# EAGLE design BlackBoard-Artemis (EAGLE 9.3.0)

## Sheet 1 of 2
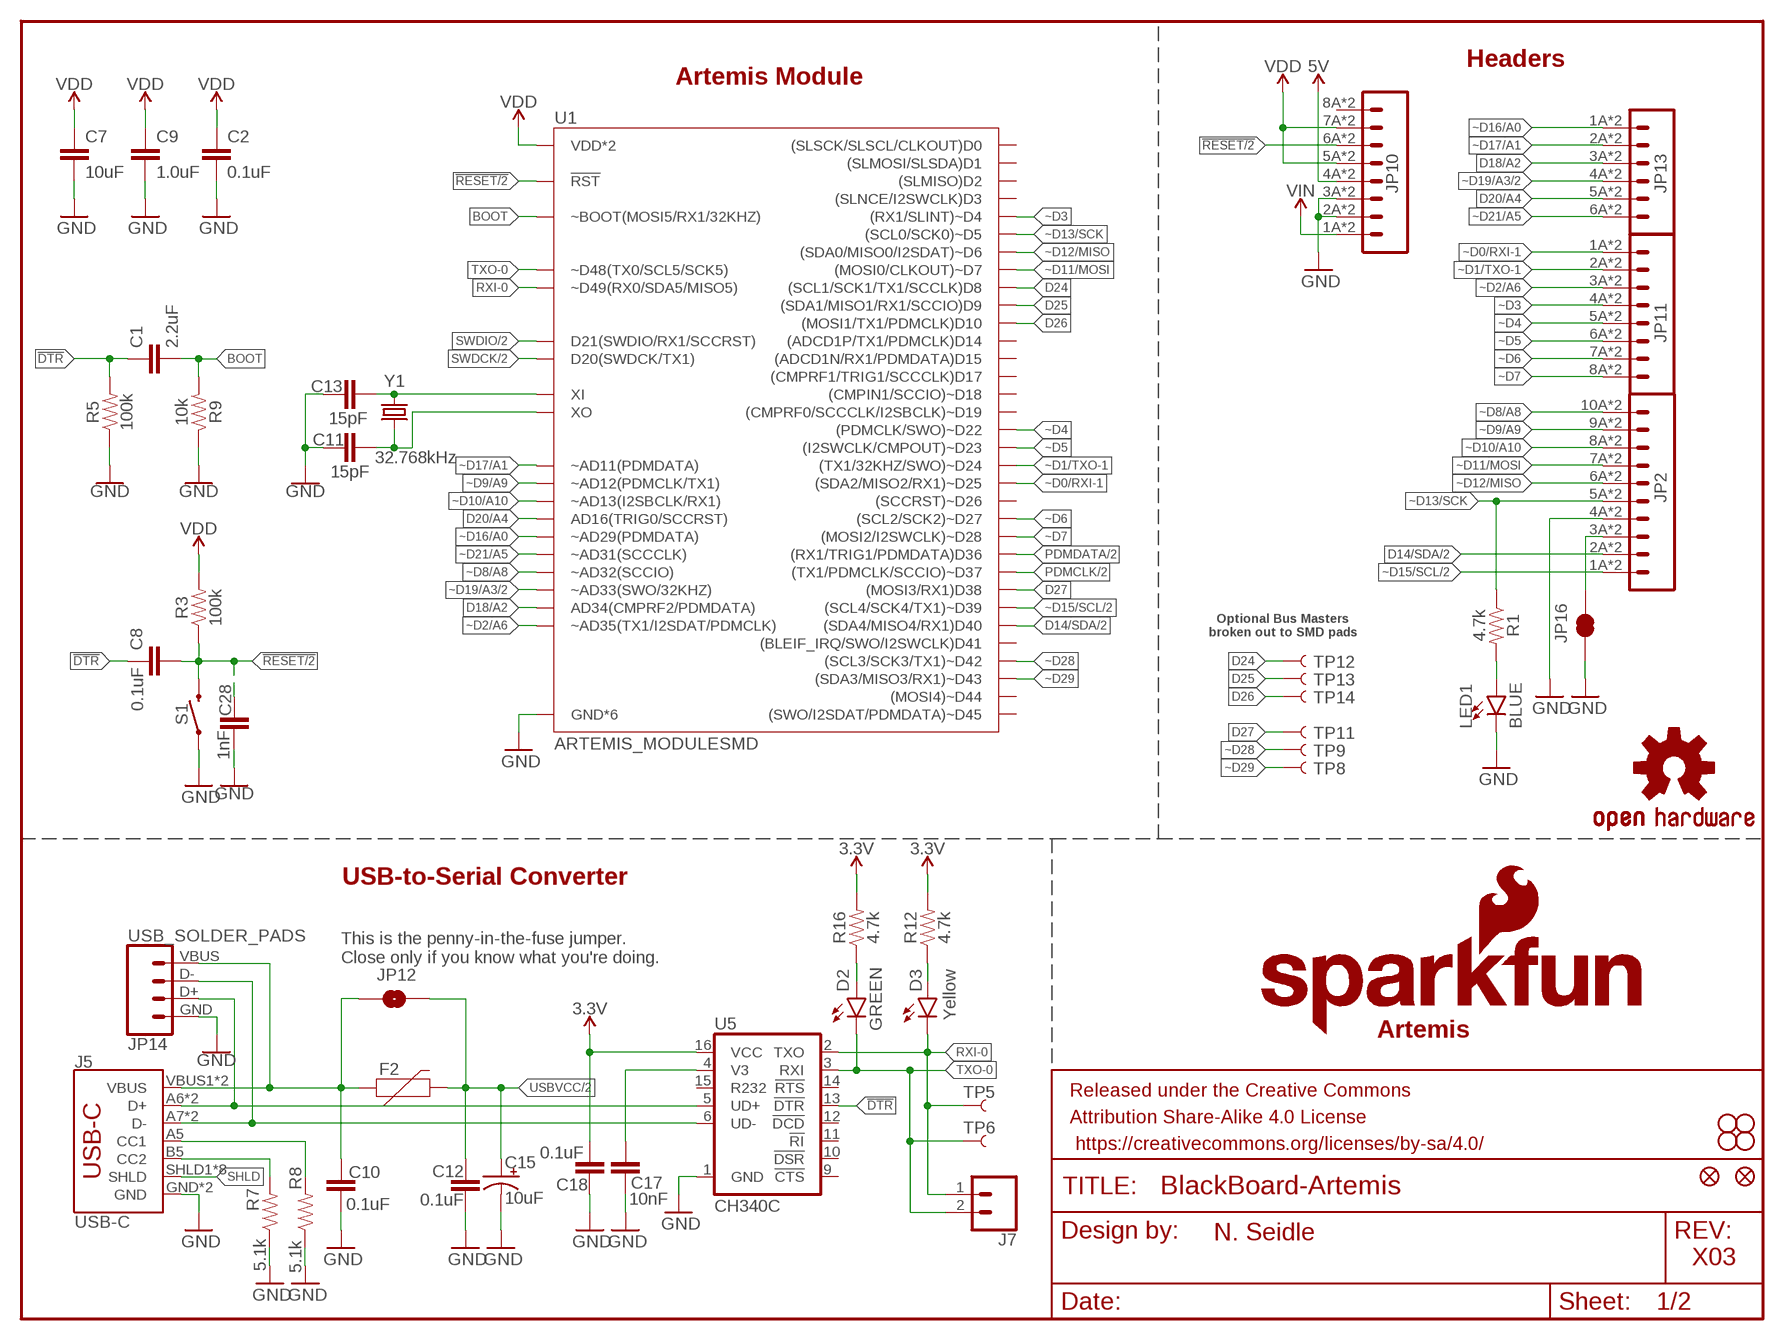
[diagram p0: schematic, sheet 1]

### Parts
C1  2.2uF  2.2UF-0603-10V-20%  [0603]
C2  0.1uF  0.1UF-0603-25V-(+80/-20%)  [0603]
C7  10uF  10UF-0603-6.3V-20%  [0603]
C8  0.1uF  0.1UF-0603-25V-5%  [0603]
C9  1.0uF  1.0UF-0603-16V-10%  [0603]
C10  0.1uF  0.1UF-0603-25V-(+80/-20%)  [0603]
C11  15pF  15PF-0603-50V-5%  [0603]
C12  0.1uF  0.1UF-0603-25V-(+80/-20%)  [0603]
C13  15pF  15PF-0603-50V-5%  [0603]
C15  10uF  10UF-POLAR-EIA3216-16V-10%(TANT)  [EIA3216]
C17  10nF  10NF-0603-50V-10%  [0603]
C18  0.1uF  0.1UF-0603-25V-(+80/-20%)  [0603]
C28  1nF  1.0NF/1000PF-0603-50V-10%  [0603]
D2  GREEN  LED-GREENLILYPAD  [LED-1206]
D3  Yellow  LED-YELLOWLILYPAD  [LED-1206]
F2  6V/2A  PPTC_6V2A  [1210]
FRAME1  FRAME-LETTER  [CREATIVE_COMMONS]
J5  USB-C  USB_C  [USB-C-16P]
J7  CONN_021X02_NO_SILK  [1X02_NO_SILK]
JP1  SFE_LOGO_NAME.1_INCH  [SFE_LOGO_NAME_.1]
JP2  M10SMD_COMBO  [1X10_SMD_COMBINED]
JP3  STAND-OFF  [STAND-OFF]
JP4  STAND-OFF  [STAND-OFF]
JP5  STAND-OFF  [STAND-OFF]
JP6  STAND-OFF  [STAND-OFF]
JP7  SFE_LOGO_FLAME.1_INCH  [SFE_LOGO_FLAME_.1]
JP8  FIDUCIAL1X2  [FIDUCIAL-1X2]
JP9  FIDUCIAL1X2  [FIDUCIAL-1X2]
JP10  M08SMD-COMBO  [1X08_SMD_COMBINED]
JP11  JP11  M08SMD-COMBO  [1X08_SMD_COMBINED]
JP12  JUMPER-SMT_2_NO_SILK  [SMT-JUMPER_2_NO_SILK]
JP13  M06SMD-STRAIGHT-COMBO  [1X06_SMD_STRAIGHT_COMBO]
JP14  USB_SOLDER_PADS  [USB-SOLDER-PADS]
JP16  JUMPER-SMT_2_NC_TRACE_SILK  [SMT-JUMPER_2_NC_TRACE_SILK]
LED1  BLUE  LED-BLUE1206  [LED-1206]
R1  4.7k  4.7KOHM-0603-1/10W-1%  [0603]
R3  100k  100KOHM-0603-1/10W-1%  [0603]
R5  100k  100KOHM-0603-1/10W-1%  [0603]
R7  5.1k  5.1KOHM5.1KOHM-0603-1/10W-1%  [0603]
R8  5.1k  5.1KOHM5.1KOHM-0603-1/10W-1%  [0603]
R9  10k  10KOHM-0603-1/10W-1%  [0603]
R12  4.7k  4.7KOHM-0603-1/10W-1%  [0603]
R16  4.7k  4.7KOHM-0603-1/10W-1%  [0603]
S1  MOMENTARY-SWITCH-SPST-SMD-5.2-TALL-REDUNDANT  [TACTILE_SWITCH_SMD_5.2MM]
TP5  TEST-POINT3X5  [PAD.03X.05]
TP6  TEST-POINT3X5  [PAD.03X.05]
TP8  TEST-POINT3X5  [PAD.03X.05]
TP9  TEST-POINT3X5  [PAD.03X.05]
TP11  TEST-POINT3X5  [PAD.03X.05]
TP12  TEST-POINT3X5  [PAD.03X.05]
TP13  TEST-POINT3X5  [PAD.03X.05]
TP14  TEST-POINT3X5  [PAD.03X.05]
U1  ARTEMIS_MODULESMD  [ARTEMIS_FP]
U5  CH340C  [SO016]
U$16  OSHW-LOGOS  [OSHW-LOGO-S]
Y1  32.768kHz  CRYSTAL-32.768KHZSMD-3.2X1.5  [CRYSTAL-SMD-3.2X1.5MM]

### Nets
3.3V: C18.1 R12.2 R16.2 U5.16(VCC) ; also sheet 2
5V [power]: JP10.4A JP10.4B ; also sheet 2
!DTR: C1.1 C8.1 R5.2 U5.13(!DTR)
!RESET: C8.2 C28.1 JP10.6A JP10.6B R3.1 S1.3 S1.4 U1.~RST(!RST) ; also sheet 2
BOOT: C1.2 R9.2 U1.BOOT(~BOOT(MOSI5/RX1/32KHZ))
CC1: J5.A5(CC1) R8.2
CC2: J5.B5(CC2) R7.2
D14/SDA: JP2.2A JP2.2B U1.D40((SDA4/MISO4/RX1)D40) ; also sheet 2
D18/A2: JP13.3A JP13.3B U1.AD34(AD34(CMPRF2/PDMDATA))
D20/A4: JP13.5A JP13.5B U1.AD16(AD16(TRIG0/SCCRST))
D24: TP12.P$1 U1.D8((SCL1/SCK1/TX1/SCCLK)D8)
D25: TP13.P$1 U1.D9((SDA1/MISO1/RX1/SCCIO)D9)
D26: TP14.P$1 U1.D10((MOSI1/TX1/PDMCLK)D10)
D27: TP11.P$1 U1.D38((MOSI3/RX1)D38)
D+: J5.A6(D+) J5.B6(D+) JP14.D+ U5.5(UD+)
D-: J5.A7(D-) J5.B7(D-) JP14.D- U5.6(UD-)
GND: C2.1 C7.2 C9.2 C10.2 C11.1 C12.2 C13.1 C15.- C17.2 C18.2 C28.2 J5.GND J5.GND2(GND) JP2.4A JP2.4B JP10.2A JP10.2B JP10.3A JP10.3B JP14.GND JP16.1 LED1.C R5.1 R7.1 R8.1 R9.1 S1.1 S1.2 U1.GND@1(GND*6) U1.GND@22(GND*6) U1.GND@38(GND*6) U1.GND@39(GND*6) U1.GND@47(GND*6) U1.GND@59(GND*6) U5.1(GND) ; also sheet 2
N$1: LED1.A R1.2
N$5: D2.A R16.1
N$6: C17.1 U5.4(V3)
N$7: C11.2 U1.XO Y1.P$2
N$8: C13.2 U1.XI Y1.P$1
N$9: D3.A R12.1
N$10: JP2.3A JP2.3B JP16.2
PDMCLK: U1.~D37((TX1/PDMCLK/SCCIO)~D37) ; also sheet 2
PDMDATA: U1.D36((RX1/TRIG1/PDMDATA)D36) ; also sheet 2
RXI-0: D3.C J7.1 TP5.P$1 U1.RXI-0(~D49(RX0/SDA5/MISO5)) U5.2(TXO)
SHLD: J5.SHLD1(SHLD) J5.SHLD2(SHLD) J5.SHLD3(SHLD) J5.SHLD4(SHLD) J5.SHLD5(SHLD) J5.SHLD6(SHLD) J5.SHLD7(SHLD) J5.SHLD8(SHLD)
SWDCK: U1.SWDCK(D20(SWDCK/TX1)) ; also sheet 2
SWDIO: U1.SWDIO(D21(SWDIO/RX1/SCCRST)) ; also sheet 2
TXO-0: D2.C J7.2 TP6.P$1 U1.TXO-0(~D48(TX0/SCL5/SCK5)) U5.3(RXI)
USBVCC [power]: C12.1 C15.+ F2.2 JP12.2 ; also sheet 2
VDD: C2.2 C7.1 C9.1 JP10.5A JP10.5B JP10.7A JP10.7B R3.2 U1.VDD@36(VDD*2) U1.VDD@37(VDD*2) ; also sheet 2
VIN [power]: JP10.1A JP10.1B ; also sheet 2
VUSB [power]: C10.1 F2.1 J5.VBUS1(VBUS) J5.VBUS2(VBUS) JP12.1 JP14.VBUS
~D0/RXI-1: JP11.1A JP11.1B U1.~D25((SDA2/MISO2/RX1)~D25)
~D1/TXO-1: JP11.2A JP11.2B U1.~D24((TX1/32KHZ/SWO)~D24)
~D2/A6: JP11.3A JP11.3B U1.~AD35(~AD35(TX1/I2SDAT/PDMCLK))
~D3: JP11.4A JP11.4B U1.~D4((RX1/SLINT)~D4)
~D4: JP11.5A JP11.5B U1.~D22((PDMCLK/SWO)~D22)
~D5: JP11.6A JP11.6B U1.~D23((I2SWCLK/CMPOUT)~D23)
~D6: JP11.7A JP11.7B U1.~D27((SCL2/SCK2)~D27)
~D7: JP11.8A JP11.8B U1.~D28((MOSI2/I2SWCLK)~D28)
~D8/A8: JP2.10A JP2.10B U1.~AD32(~AD32(SCCIO))
~D9/A9: JP2.9A JP2.9B U1.~AD12(~AD12(PDMCLK/TX1))
~D10/A10: JP2.8A JP2.8B U1.~AD13(~AD13(I2SBCLK/RX1))
~D11/MOSI: JP2.7A JP2.7B U1.D7((MOSI0/CLKOUT)~D7)
~D12/MISO: JP2.6A JP2.6B U1.~D6((SDA0/MISO0/I2SDAT)~D6)
~D13/SCK: JP2.5A JP2.5B R1.1 U1.~D5((SCL0/SCK0)~D5)
~D15/SCL: JP2.1A JP2.1B U1.~D39((SCL4/SCK4/TX1)~D39) ; also sheet 2
~D16/A0: JP13.1A JP13.1B U1.~AD29(~AD29(PDMDATA))
~D17/A1: JP13.2A JP13.2B U1.~AD11(~AD11(PDMDATA))
~D19/A3: JP13.4A JP13.4B U1.~AD33/SWO(~AD33(SWO/32KHZ)) ; also sheet 2
~D21/A5: JP13.6A JP13.6B U1.~AD31(~AD31(SCCCLK))
~D28: TP9.P$1 U1.~D42((SCL3/SCK3/TX1)~D42)
~D29: TP8.P$1 U1.~D43((SDA3/MISO3/RX1)~D43)
Unconnected: JP10.8A JP10.8B U1.D0((SLSCK/SLSCL/CLKOUT)D0) U1.D1((SLMOSI/SLSDA)D1) U1.D2((SLMISO)D2) U1.D3((SLNCE/I2SWCLK)D3) U1.D14((ADCD1P/TX1/PDMCLK)D14) U1.D15((ADCD1N/RX1/PDMDATA)D15) U1.D17((CMPRF1/TRIG1/SCCCLK)D17) U1.D41((BLEIF_IRQ/SWO/I2SWCLK)D41) U1.~D18((CMPIN1/SCCIO)~D18) U1.~D19((CMPRF0/SCCCLK/I2SBCLK)~D19) U1.~D26((SCCRST)~D26) U1.~D44((MOSI4)~D44) U1.~D45((SWO/I2SDAT/PDMDATA)~D45) U5.9(!CTS) U5.10(!DSR) U5.11(!RI) U5.12(!DCD) U5.14(!RTS) U5.15(R232)

### Notes on the sheet
- Headers
- Artemis Module
- Optional Bus Masters
  broken out to SMD pads
- USB-to-Serial Converter
- This is the penny-in-the-fuse jumper.
  Close only if you know what you're doing.
- Artemis
- N. Seidle
- X03

## Sheet 2 of 2
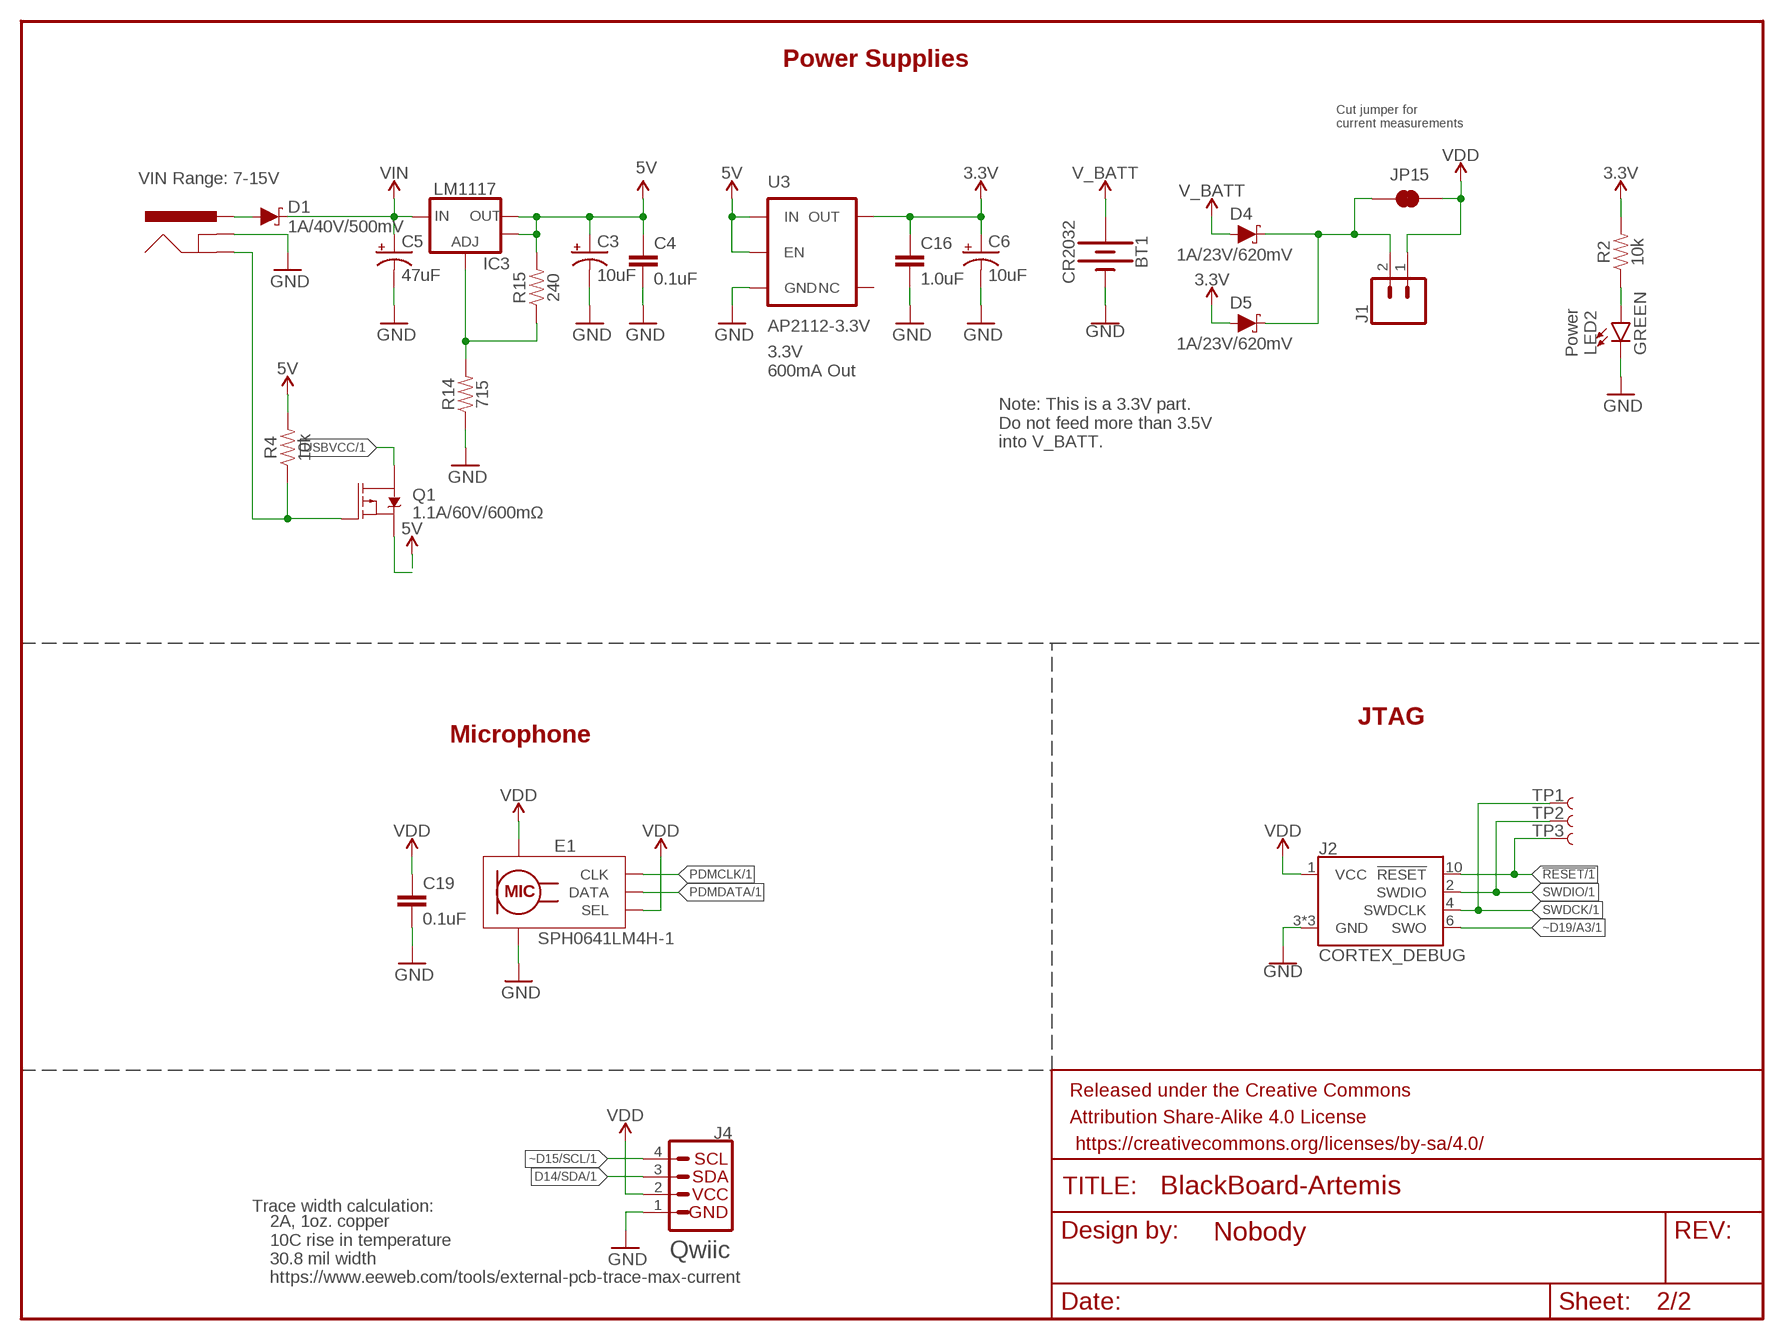
[diagram p1: schematic, sheet 2]

### Parts
BT1  CR2032  BATTERY-20MM_SMD_4LEGS_OVERPASTE  [BATTCON_20MM_4LEGS_OVERPASTE]
C3  10uF  10UF-POLAR-EIA3216-16V-10%(TANT)  [EIA3216]
C4  0.1uF  0.1UF-0603-25V-(+80/-20%)  [0603]
C5  47uF  47UF-POLAR-PANASONIC_D-35V-20%  [PANASONIC_D]
C6  10uF  10UF-POLAR-EIA3216-16V-10%(TANT)  [EIA3216]
C16  1.0uF  1.0UF-0603-16V-10%  [0603]
C19  0.1uF  0.1UF-0603-25V-(+80/-20%)  [0603]
D1  1A/40V/500mV  DIODE-SCHOTTKY-SS14  [SMA-DIODE]
D4  1A/23V/620mV  DIODE-SCHOTTKY-BAT20J  [SOD-323]
D5  1A/23V/620mV  DIODE-SCHOTTKY-BAT20J  [SOD-323]
E1  SPH0641LM4H-1  SPH0641LM4H-1_MICROPHONE  [SPH0641LM4H-1_MICROPHONE]
FRAME2  FRAME-LETTERNO_PACKAGE  [DUMMY]
IC3  LM1117  V_REG_LM1117ALT1  [SOT223-ALT1]
J1  CONN_021X02_NO_SILK  [1X02_NO_SILK]
J2  CORTEX_DEBUG  CORTEX_DEBUG_MINIMUM_PTH_NS  [2X5-PTH-1.27MM-NO_SILK]
J3  POWER_JACKTOE  [POWER_JACK_SMD_OVERPASTE_TOE]
J4  QWIIC_CONNECTORJS-1MM  [JST04_1MM_RA]
JP15  JUMPER-SMT_2_NC_TRACE_SILK  [SMT-JUMPER_2_NC_TRACE_SILK]
LED2  GREEN  LED-GREENLILYPAD  [LED-1206]
Q1  1.1A/60V/600mΩ  MOSFET_PCH-SI2309DS  [SOT23-3]
R2  10k  10KOHM-0603-1/10W-1%  [0603]
R4  10k  10KOHM-0603-1/10W-1%  [0603]
R14  715  715OHM-0603-1/10W-1%  [0603]
R15  240  240OHM-0603-1/10W-1%  [0603]
TP1  TEST-POINT3X5  [PAD.03X.05]
TP2  TEST-POINT3X5  [PAD.03X.05]
TP3  TEST-POINT3X5  [PAD.03X.05]
U3  AP2112-3.3V  V_REG_AP2112K-3.3V  [SOT23-5]

### Nets
3.3V: C6.+ C16.1 D5.A R2.2 U3.5(OUT) ; also sheet 1
5V [power]: C3.+ C4.1 IC3.2(OUT) IC3.4(OUT) Q1.2(S) R4.2 R15.2 U3.1(IN) U3.3(EN) ; also sheet 1
!RESET: J2.10(!RESET) TP3.P$1 ; also sheet 1
D14/SDA: J4.3 ; also sheet 1
GND: BT1.2(-) C3.- C4.2 C5.- C6.- C16.2 C19.2 E1.3(GND) E1.6(GND) E1.7(GND) E1.8(GND) J2.3(GND) J2.5(GND) J2.9(GND) J3.GND(GNDBREAK) J4.1 LED2.C R14.1 U3.2(GND) ; also sheet 1
INSERT: J3.P$4(GND) Q1.1(G) R4.1
N$2: LED2.A R2.1
N$3: D4.C D5.C J1.2 JP15.1
N$15: IC3.1(ADJ) R14.2 R15.1
PDMCLK: E1.4(CLK) ; also sheet 1
PDMDATA: E1.1(DATA) ; also sheet 1
PWRIN [power]: D1.A J3.VIN0(PWR)
SWDCK: J2.4(SWDCLK) TP1.P$1 ; also sheet 1
SWDIO: J2.2(SWDIO) TP2.P$1 ; also sheet 1
USBVCC [power]: Q1.3(D) ; also sheet 1
V_BATT: BT1.1(+) D4.A
VDD: C19.1 E1.2(SEL) E1.5(VDD) J1.1 J2.1(VCC) J4.2 JP15.2 ; also sheet 1
VIN [power]: C5.+ D1.C IC3.3(IN) ; also sheet 1
~D15/SCL: J4.4 ; also sheet 1
~D19/A3: J2.6(SWO) ; also sheet 1
Unconnected: U3.4(NC)

### Notes on the sheet
- Power Supplies
- Cut jumper for
  current measurements
- VIN Range: 7-15V
- Power
- 3.3V
  600mA Out
- Note: This is a 3.3V part.
  Do not feed more than 3.5V
  into V_BATT.
- JTAG
- Microphone
- Trace width calculation:
- Qwiic
- 2A, 1oz. copper
  10C rise in temperature
  30.8 mil width
  https://www.eeweb.com/tools/external-pcb-trace-max-current

## Library data of the parts
BT1 = SparkFun-Batteries:BATTERY: Battery - Single Cell A variety of battery chemistries, sizes, and footprints. Device List: 20MM_PTH - Coin Cell Battery Holder - 20mm (PTH) <https://www.sparkfun.com/products/783> 20MM_PTH_KIT- Coin Cell battery Holder - 20 mm (PTH) <http://www.sparkfun.com/products/783>kit version with special mask 6.8MM_PTH - Coin Cell Battery Holder - 6.8MM(SMD) <https://www.digikey.com/product-detail/en/seiko-instruments/MS621FE-FL11E/728-1057-ND/1889208?WT.srch=1&gclid=CNOQ5a6LzdQCFZS2wAodXCkE0g> 12MM_SMD - Coin Cell Battery Holder - 12mm (SMD) <https://www.sparkfun.com/products/10592> 12MM_PTH - Coin Cell Battery Holder - 12mm (PTH) <https://www.sparkfun.com/products/7948> 20MM_SMD - 20mm Coin Cell Battery Holder (SMD) (2 legs) Used on the Big Time Watch Kit <https://www.sparkfun.com/products/11734> 20MM_SMD_4LEGS - Coin Cell Battery Holder - 20mm (SMD) <https://www.sparkfun.com/products/11892> 20MM_SMD_4LEGS_OVERPASTE - Coin Cell Battery Holder - 20mm (SMD) <https://www.sparkfun.com/products/11892> (Over-paste on the legs) 24.5MM_PTH - Coin Cell Battery Holder - 24.5mm (PTH) <https://www.sparkfun.com/products/8863> 9V - 9V Battery Holder - PC Mount Used on the SparkFun SparkPunk Sound Kit <https://www.sparkfun.com/products/11177> and SparkFun SparkPunk Sequencer Kit <https://www.sparkfun.com/products/12707> 18650 - Battery Holder - 18650 (PTH) <https://www.sparkfun.com/products/13113> AA - Battery Holder - 1xAA (PTH) <https://www.sparkfun.com/products/7949> AAA - Battery Holder - 1xAAA (PTH) <https://www.sparkfun.com/products/12718> AA_KIT - Battery Holder - 1xAA (PTH) <https://www.sparkfun.com/products/7949> Special kit package - pads only have exposed copper on one side of the board. AAA_KIT - Battery Holder - 1xAAA (PTH) <https://www.sparkfun.com/products/12718> Special kit package - pads only have exposed copper on one side of the board.; PROD_ID: PRT-11892; SF_SKU: BATT-10373
C1 = SparkFun-Capacitors:2.2UF: 2.2µF ceramic capacitors A capacitor is a passive two-terminal electrical component used to store electrical energy temporarily in an electric field.; PROD_ID: CAP-07888
C2 C4 C10 C12 C18 C19 = SparkFun-Capacitors:0.1UF: 0.1µF ceramic capacitors A capacitor is a passive two-terminal electrical component used to store electrical energy temporarily in an electric field.; PROD_ID: CAP-00810
C3 C6 C15 = SparkFun-Capacitors:10UF-POLAR: 10.0µF polarized capacitors A capacitor is a passive two-terminal electrical component used to store electrical energy temporarily in an electric field.; PROD_ID: CAP-00811
C5 = SparkFun-Capacitors:47UF-POLAR: 47µF polarized capacitors A capacitor is a passive two-terminal electrical component used to store electrical energy temporarily in an electric field.; PROD_ID: CAP-08478
C7 = SparkFun-Capacitors:10UF: 10.0µF ceramic capacitors A capacitor is a passive two-terminal electrical component used to store electrical energy temporarily in an electric field.; PROD_ID: CAP-11015
C8 = SparkFun-Capacitors:0.1UF: 0.1µF ceramic capacitors A capacitor is a passive two-terminal electrical component used to store electrical energy temporarily in an electric field.; PROD_ID: CAP-08604
C9 C16 = SparkFun-Capacitors:1.0UF: 1µF ceramic capacitors A capacitor is a passive two-terminal electrical component used to store electrical energy temporarily in an electric field.; PROD_ID: CAP-00868
C11 C13 = SparkFun-Capacitors:15PF: 15pF ceramic capacitors A capacitor is a passive two-terminal electrical component used to store electrical energy temporarily in an electric field.; PROD_ID: CAP-07881
C17 = SparkFun-Capacitors:10NF: 0.01uF/10nF/10,000pF ceramic capacitors A capacitor is a passive two-terminal electrical component used to store electrical energy temporarily in an electric field. CAP-09321; PROD_ID: CAP-00867
C28 = SparkFun-Capacitors:1.0NF/1000PF: 1nF/1,000pF ceramic capacitors A capacitor is a passive two-terminal electrical component used to store electrical energy temporarily in an electric field.; PROD_ID: CAP-07886
D1 = SparkFun-DiscreteSemi:DIODE-SCHOTTKY: Schottky diode A Schottky diode is a semiconductor diode which has a low forward voltage drop and a very fast switching action.; PROD_ID: DIO-08053
D2 LED2 = SparkFun-LED:LED-GREEN: Green SMD LED Used in manufacturing of various products at SparkFun Packages: 0603 - SMD 0603 package [Product Link] <http://www.futureelectronics.com/en/technologies/semiconductors/optoelectronics/leds/Pages/9894312-LTST-C190GKT.aspx?CrossPart=HSMG-C190&IM=0> LilyPad 1206 - SMD1206 LilyPad package [Product Link] <http://www.futureelectronics.com/en/Technologies/Product.aspx?ProductID=IN150NGHARVATEKCORPORATION2049943&IM=0> 1206 - SMD1206 package [Product Link] <http://www.futureelectronics.com/en/technologies/semiconductors/optoelectronics/leds/Pages/8315665-LTST-C150KGKT.aspx?IM=0> 1206 Bottom Mount -SMD 1206 Bottom Mount [Product Link] <http://www.digikey.com/product-detail/en/lite-on-inc/LTST-C230KGKT/160-1456-1-ND/386854> SparkFun Products: Pro Mini 328 -5V <https://www.sparkfun.com/products/821> RedBoard <https://www.sparkfun.com/products/12757> MP3 Trigger <https://www.sparkfun.com/products/13720> Makey Makey <https://www.sparkfun.com/products/11076>; PROD_ID: DIO-09910
D3 = SparkFun-LED:LED-YELLOW: Yellow SMD LED Used in manufacturing several products at SparkFun. Packages: 0603 - SMD 0603 package[Product Link] <http://www.kingbrightusa.com/product.asp?catalog_name=LED&product_id=APT1608SYCK> 0603 -SMART - SMART SMD 0603 package (more efficient/more expensive) [Product Link] <http://www.osram-os.com/osram_os/en/products/product-catalog/led-light-emitting-diodes/smartled-0603/ly-l29k/index.jsp> LilyPad - SMD1206 package[Product Datasheet] <https://www.sparkfun.com/datasheets/DevTools/LilyPad/Q150YUS4.pdf> SparkFun Products: Blynk Board <https://www.sparkfun.com/products/13794> IOIO-OTG <https://www.sparkfun.com/products/13613> XBee Explorer Serial <https://www.sparkfun.com/products/13225>; PROD_ID: DIO-09909
D4 D5 = SparkFun-DiscreteSemi:DIODE-SCHOTTKY: Schottky diode A Schottky diode is a semiconductor diode which has a low forward voltage drop and a very fast switching action.; PROD_ID: DIO-11623
E1 = SparkFun-Sensors:SPH0641LM4H-1_MICROPHONE: SPH0641LM4H-1 Microphone A miniature, high-performance, low power, bottom port silicon digital microphone with a single bit PDM output.; PROD_ID: IC-14361
F2 = SparkFun-Fuses:PPTC: Resettable Fuse PPTC Resettable Fuse. Really a sort of resistor with a polymeric positive temperature coefficient whose resistance increases dramatically with an increase in temperature. When heated by the power passing through the resistance rises causing the current to be limited, protecting the circuit. This is achieved by the transition of the polymer from a crystalline to an amorphous state where the conductive carbon separates breaking the conductive pathways found in the cool crystalline structure. When a PPTC cools back down it resumes conducting letting the circuit turn back on. SparkFun Products: SparkFun RedBoard - Programmed with Arduino <https://www.sparkfun.com/products/12757> Pro Micro - 5V/16MHz <https://www.sparkfun.com/products/12640> Arduino Pro 328 - 5V/16MHz <https://www.sparkfun.com/products/10915> MP3 Trigger <https://www.sparkfun.com/products/13720>; PROD_ID: RES-14313
FRAME1 = SparkFun-Aesthetics:FRAME-LETTER: Schematic Frame - Letter Standard 8.5x11 US Letter frame
FRAME2 = SparkFun-Aesthetics:FRAME-LETTER: Schematic Frame - Letter Standard 8.5x11 US Letter frame; DESIGNER: Nobody; VERSION: v01
IC3 = Testing:V_REG_LM1117: Voltage Regulator LM1117 Standard adjustable voltage regulator but in SMD form. Spark Fun Electronics SKU : COM-00595; PROD_ID: VREG-08170
J1 J7 = SparkFun-Connectors:CONN_02: Multi connection point. Often used as Generic Header-pin footprint for 0.1 inch spaced/style header connections On any of the 0.1 inch spaced packages, you can populate with these: Break Away Headers - Straight <https://www.sparkfun.com/products/116> (PRT-00116) Break Away Male Headers - Right Angle <https://www.sparkfun.com/products/553> (PRT-00553) Female Headers <https://www.sparkfun.com/products/115> (PRT-00115) Break Away Headers - Machine Pin <https://www.sparkfun.com/products/117> (PRT-00117) Break Away Female Headers - Swiss Machine Pin <https://www.sparkfun.com/products/743> (PRT-00743) For SCREWTERMINALS and SPRING TERMINALS visit here: Screw Terimnals on SparkFun.com <https://www.sparkfun.com/search/results?term=Screw+Terminals> (5mm/3.5mm/2.54mm spacing) This device is also useful as a general connection point to wire up your design to another part of your project. Our various solder wires solder well into these plated through hole pads. Hook-Up Wire - Assortment (Stranded, 22 AWG) <https://www.sparkfun.com/products/11375> (PRT-11375) Hook-Up Wire - Assortment (Solid Core, 22 AWG) <https://www.sparkfun.com/products/11367> (PRT-11367) View the entire wire category on our website here <https://www.sparkfun.com/categories/141> Special notes: Molex polarized connector foot print use with: PRT-08233 with associated crimp pins and housings. 2.54_SCREWTERM for use with PRT-10571. 3.5mm Screw Terminal footprints for PRT-08084 5mm Screw Terminal footprints for use with PRT-08432
J2 = SparkFun-Connectors:CORTEX_DEBUG_MINIMUM: Cortex Debug Connector - 10 pin Supports JTAG debug, Serial Wire debug, and Serial Wire Viewer. PTH and SMD connector options available. General Connector Information <http://infocenter.arm.com/help/topic/com.arm.doc.faqs/attached/13634/cortex_debug_connectors.pdf> Products: PTH Connector <http://www.digikey.com/product-detail/en/cnc-tech/3220-10-0100-00/1175-1627-ND/3883661> -via Digi-Key SparkFun PSoc <https://www.sparkfun.com/products/13229> SparkFun T <https://www.sparkfun.com/products/13810>
J3 = SparkFun-Connectors:POWER_JACK: Power Jack Connector This is the standard 5.5mm barrel jack for power. The PTH is the most common, proven, reliable, footprint. The Slot footprint only works if the mill layer is transmitted to the PCB fab house so be warned. Here are the connectors we sell at SparkFun: DC Barrel Power Jack/Connector <https://www.sparkfun.com/products/119> (PRT-00119) DC Barrel Power Jack/Connector (SMD) <https://www.sparkfun.com/products/12748> (PRT-12748) DC Barrel Jack Adapter - Breadboard Compatible <https://www.sparkfun.com/products/10811> (PRT-10811) It is used on this SparkFun product (and many, many others): SparkFun RedBoard - Programmed with Arduino <https://www.sparkfun.com/products/12757> (DEV-12757) Also, if you need a mating power supply or connector, please check these out: Wall Adapter Power Supply - 9VDC 650mA <https://www.sparkfun.com/products/298> (TOL-00298) DC Barrel Jack Adapter - Male <https://www.sparkfun.com/products/10287> (PRT-10287); PROD_ID: CONN-08106; SF_ID: PRT-12748
J4 = SparkFun-Connectors:QWIIC_CONNECTOR: SparkFun I2C Standard Qwiic Connector An SMD 1mm pitch JST connector makes it easy and quick (get it? Qwiic?) to connect I2C devices to each other. The Qwiic system <http://www.sparkfun.com/qwiic> enables fast and solderless connection between popular platforms and various sensors and actuators. We carry 200mm <https://www.sparkfun.com/products/14204>, 100mm <https://www.sparkfun.com/products/14205>, 50mm <https://www.sparkfun.com/products/14206>, and breadboard friendly <https://www.sparkfun.com/products/14207> Qwiic cables. We also offer 10 pcs strips <https://www.sparkfun.com/products/14323> the SMD connectors.; PROD_ID: CONN-13694
J5 = SparkFun-Connectors:USB_C: USB Type C 16Pin Connector Super Speed pins not available on the 16-pin purely SMD connector so this part is best for USB 2.0 implementations. D1 and D2 are tied together enabling D+/- no matter which way the cable is plugged into the connector. The two channel configuration pins (CC1/2) are exposed. These are normally connected to ground via 5.1k resistors but can be reconfigured for high current/high power applications.; PROD_ID: CONN-14122; VALUE: USB Female Type C Connector
JP1 = SparkFun-Aesthetics:SFE_LOGO_NAME: SparkFun Font Logo This is the SparkFun name logo. The logo on the schematic will always be the same size; the package variant is the height of the flame part of the logo (or the height the flame would be, if it were drawn). Default layer for the logo on the board is tSilk.
JP2 = SparkFun-Connectors:M10: Header 10 Standard 10-pin 0.1" header. Use with straight break away headers (SKU : PRT-00116), right angle break away headers (PRT-00553), swiss pins (PRT-00743), machine pins (PRT-00117), and female headers (PRT-00115).; PROD_ID: CONN-11219
JP3-JP6 = SparkFun:STAND-OFF: Stand Off This is the mechanical footprint for a #4 phillips button head screw. Use the keepout ring to avoid running the screw head into surrounding components. SKU : PRT-00447
JP7 = SparkFun-Aesthetics:SFE_LOGO_FLAME: SparkFun Flame Logo This is the SparkFun flame logo. The logo on the schematic will always be the same size; the package variant is the height of the flame. Default layer for the logo on the board is tSilk.
JP8 JP9 = SparkFun:FIDUCIAL: Fiducial Alignment Points Various fiducial points for machine vision alignment.
JP10 JP11 = SparkFun-Connectors:M08: Header 8 Standard 8-pin 0.1" header. Use with straight break away headers (SKU : PRT-00116), right angle break away headers (PRT-00553), swiss pins (PRT-00743), machine pins (PRT-00117), and female headers (PRT-00115).; PROD_ID: CONN-10204
JP12 = SparkFun-Jumpers:JUMPER-SMT_2_NO: Normally open jumper This jumper has two pads in close proximity to each other. Apply solder to close the connection. Round pads are easier to solder for beginners, but are a lot larger. SparkFun Product that uses the round pads: SparkFun EL Sequencer <https://www.sparkfun.com/products/12781>
JP13 = SparkFun-Connectors:M06: Header 6 Standard 6-pin 0.1" header. Use with straight break away headers (SKU : PRT-00116), right angle break away headers (PRT-00553), swiss pins (PRT-00743), machine pins (PRT-00117), and female headers (PRT-00115). Molex polarized connector foot print use with SKU : PRT-08094 with associated crimp pins and housings. NOTES ON THE VARIANTS LOCK and LOCK_LONGPADS... This footprint was designed to help hold the alignment of a through-hole component (i.e. 6-pin header) while soldering it into place. You may notice that each hole has been shifted either up or down by 0.005 of an inch from it's more standard position (which is a perfectly straight line). This slight alteration caused the pins (the squares in the middle) to touch the edges of the holes. Because they are alternating, it causes a "brace" to hold the component in place. 0.005 has proven to be the perfect amount of "off-center" position when using our standard breakaway headers. Although looks a little odd when you look at the bare footprint, once you have a header in there, the alteration is very hard to notice. Also,if you push a header all the way into place, it is covered up entirely on the bottom side. This idea of altering the position of holes to aid alignment will be further integrated into the Sparkfun Library for other footprints. It can help hold any component with 3 or more connection pins.; PROD_ID: CONN-10203
JP14 = SparkFun-Connectors:USB_SOLDER_PADS: Solder pad access to USB pins. Helpful to expose on PCBs so user can attach external USB connector if necessary.
JP15 JP16 = SparkFun-Jumpers:JUMPER-SMT_2_NC_TRACE: Normally closed trace jumper This jumper has a trace between two pads so it's normally closed (NC). Use a razor knife to open the connection. For best results follow the IPC guidelines for cutting traces: Cutout at least 0.063 mm (0.005 in). Remove all loose material to clean up the cut area. Seal the cut with an approved epoxy. Reapply solder to reclose the connection.
LED1 = SparkFun-LED:LED-BLUE: Blue SMD LED Used in manufacturing of various products at SparkFun Packages: 0603 - SMD 0603 package [Product Link] <http://www.digikey.com/product-detail/en/SMLE12BC7TT86/511-1589-2-ND/1641808> 1206 - SMD1206 package [Product Link] <http://www.digikey.com/product-detail/en/lite-on-inc/LTST-C150TBKT/160-1643-1-ND/573584> SparkFun Products: ESP8266 Thing-Dev Board <https://www.sparkfun.com/products/13711> RedBoard <https://www.sparkfun.com/products/12757>; PROD_ID: DIO-09911
Q1 = SparkFun-DiscreteSemi:MOSFET_PCH: P-channel MOSFETs Voltage controlled devices that allow control of high current outputs. SparkFun Products: SparkFun ESP32 Thing <https://www.sparkfun.com/products/13907> SparkFun ESP8266 Thing <https://www.sparkfun.com/products/13231> SparkFun Pi Servo HAT V2 <https://www.sparkfun.com/products/15316> DMG2305UX-7 (20V/4.2A/SOT23-3); PROD_ID: TRANS-08285
R1 R12 R16 = SparkFun-Resistors:4.7KOHM: 4.7kΩ resistor A resistor is a passive two-terminal electrical component that implements electrical resistance as a circuit element. Resistors act to reduce current flow, and, at the same time, act to lower voltage levels within circuits. - Wikipedia; PROD_ID: RES-07857
R2 R4 R9 = SparkFun-Resistors:10KOHM: 10kΩ resistor A resistor is a passive two-terminal electrical component that implements electrical resistance as a circuit element. Resistors act to reduce current flow, and, at the same time, act to lower voltage levels within circuits. - Wikipedia; PROD_ID: RES-00824
R3 R5 = SparkFun-Resistors:100KOHM: 100kΩ resistor A resistor is a passive two-terminal electrical component that implements electrical resistance as a circuit element. Resistors act to reduce current flow, and, at the same time, act to lower voltage levels within circuits. - Wikipedia; PROD_ID: RES-07828
R7 R8 = SparkFun-Resistors:5.1KOHM; PROD_ID: RES-12083
R14 = SparkFun-Resistors:715OHM: 715Ω resistor A resistor is a passive two-terminal electrical component that implements electrical resistance as a circuit element. Resistors act to reduce current flow, and, at the same time, act to lower voltage levels within circuits. - Wikipedia; PROD_ID: RES-07850
R15 = SparkFun-Resistors:240OHM: 240Ω resistor A resistor is a passive two-terminal electrical component that implements electrical resistance as a circuit element. Resistors act to reduce current flow, and, at the same time, act to lower voltage levels within circuits. - Wikipedia; PROD_ID: RES-07849
S1 = SparkFun-Switches:MOMENTARY-SWITCH-SPST: Momentary Switch (Pushbutton) - SPST Normally-open (NO) SPST momentary switches (buttons, pushbuttons). Variants PTH-12MM - 12mm square, through-hole Momentary Pushbutton Switch - 12mm Square <https://www.sparkfun.com/products/9190> (COM-09190) PTH-6.0MM, PTH-6.0MM-KIT - 6.0mm square, through-hole Mini Pushbutton Switch <https://www.sparkfun.com/products/97> (COM-00097) KIT package intended for soldering kit's - only one side of pads' copper is exposed. PTH-RIGHT-ANGLE-KIT - Right-angle, through-hole Right Angle Tactile Button <https://www.sparkfun.com/products/10791> - Used on SparkFun BigTime Watch Kit <https://www.sparkfun.com/products/11734> SMD-12MM - 12mm square, surface-mount Tactile Button - SMD (12mm) <https://www.sparkfun.com/products/12993> (COM-12993) Used on SparkFun PicoBoard <https://www.sparkfun.com/products/11888> SMD-4.5MM - 4.5mm Square Trackball Switch Used on SparkFun Blackberry Trackballer Breakout <https://www.sparkfun.com/products/13169> SMD-4.6MMX2.8MM - 4.60mm x 2.80mm, surface mount Used on SparkFun SAMD21 Mini Breakout <https://www.sparkfun.com/products/13664> SMD-5.2MM, SMD-5.2-REDUNDANT - 5.2mm square, surface-mount Mini Pushbutton Switch - SMD <https://www.sparkfun.com/products/8720> (COM-08720) Used on Arduino Pro Mini <https://www.sparkfun.com/products/11114> REDUNDANT package connects both switch circuits together SMD-6.0X3.5MM - 6.0 x 3.5mm, surface mount Momentary Reset Switch SMD <https://www.sparkfun.com/products/8229> (COM-08229) SMD-6.2MM-TALL - 6.2mm square, surface mount Tactile Button - SMD (6mm) <https://www.sparkfun.com/products/12992> Used on SparkFun Digital Sandbox <https://www.sparkfun.com/products/12651> SMD-RIGHT-ANGLE - Right-angle, surface mount Used on SparkFun Block for Intel® Edison - Arduino <https://www.sparkfun.com/products/13036>; PROD_ID: SWCH-14139
TP1-TP3 TP5 TP6 TP8 TP9 TP11-TP14 = SparkFun-Connectors:TEST-POINT: SparkFun Test Points Bare copper test points for troubleshooting or In-Circuit-Testing. These are used by our Production team for verifying production board runs using pogo-pins on test beds. SparkFun Products: SparkFun LSM9DS1 Breakout <https://www.sparkfun.com/products/13284> SparkFun PSOC <https://www.sparkfun.com/products/13714> SparkFun Load Cell Amplifier <https://www.sparkfun.com/products/13879>
U1 = Testing:ARTEMIS_MODULE
U3 = SparkFun-PowerIC:V_REG_AP2112: AP2112 - 600mA CMOS LDO Regulator w/ Enable The AP2112 is CMOS process low dropout linear regulator with enable function, the regulator delivers a guaranteed 600mA (min.) continuous load current. Features Output Voltage Accuracy: ±1.5% Output Current: 600mA (Min.) Foldback Short Current Protection: 50mA Enable Function to Turn ON/OFF VOUT Low Dropout Voltage (3.3V): 250mV (Typ.) @IOUT=600mA Excellent Load Regulation: 0.2%/A (Typ.) Excellent Line Regulation: 0.02%/V (Typ.) Low Quiescent Current: 55μA (Typ.) Low Standby Current: 0.01μA (Typ.) Low Output Noise: 50μVRMS PSRR: 100Hz -65dB, 1kHz -65dB OTSD Protection Stable with 1.0μF Flexible Cap: Ceramic, Tantalum and Aluminum Electrolytic Operation Temperature Range: -40°C to 85°C ESD: MM 400V, HBM 4000V; PROD_ID: VREG-12457; VALUE: 3.3V
U5 = SparkFun-IC-Comms:CH340C; PROD_ID: IC-14038
U$16 = SparkFun-Aesthetics:OSHW-LOGO: Open-Source Hardware (OSHW) Logo This logo indicates the piece of hardware it is found on incorporates a OSHW license and/or adheres to the definition of open source hardware found here: http://freedomdefined.org/OSHW
Y1 = SparkFun-Clocks:CRYSTAL-32.768KHZ: 32.768kHz Crystal Frequency: 32.768kHz Frequency Stability: ±20ppm Load Capacitance: 12.5pF (PTH-2X6 & SMD-3.2X1.5), 6pF (SMD-2X6) SparkFun Products: SparkFun BigTime Watch Kit <https://www.sparkfun.com/products/11734> SparkFun nRF52832 Breakout <https://www.sparkfun.com/products/13990> SparkFun Real Time Clock Module <https://www.sparkfun.com/products/12708>; PROD_ID: XTAL-13062

## Net classes
0 default: width 0 mm, drill 0 mm
1 power: width 0.762 mm

## Board
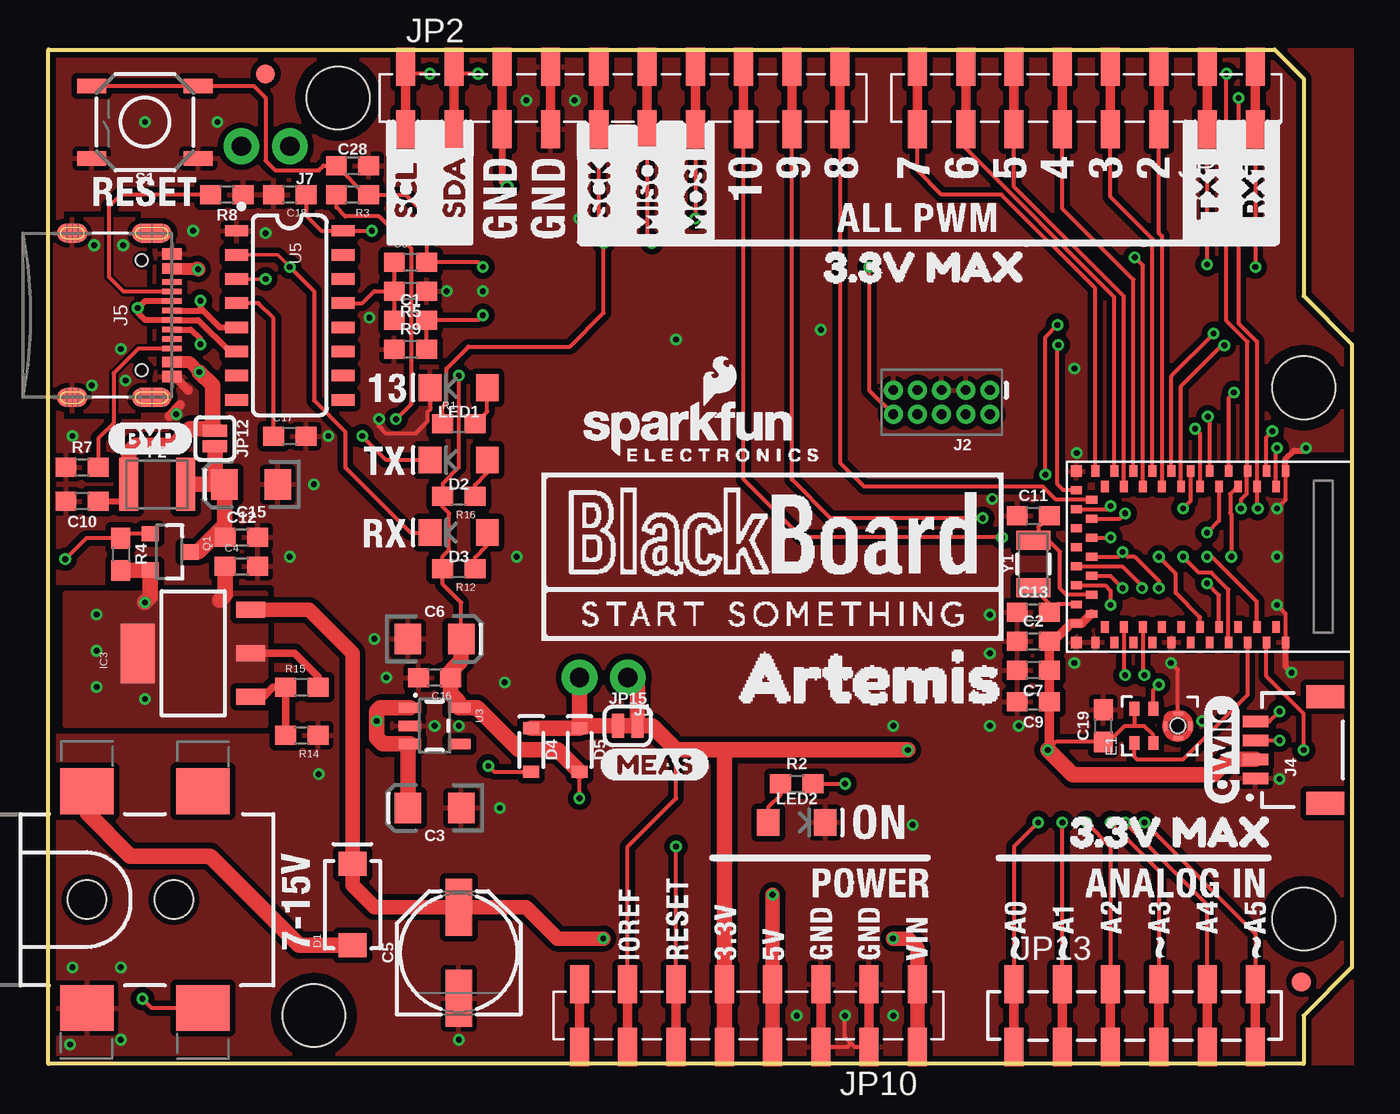
[diagram p2: board, top side]
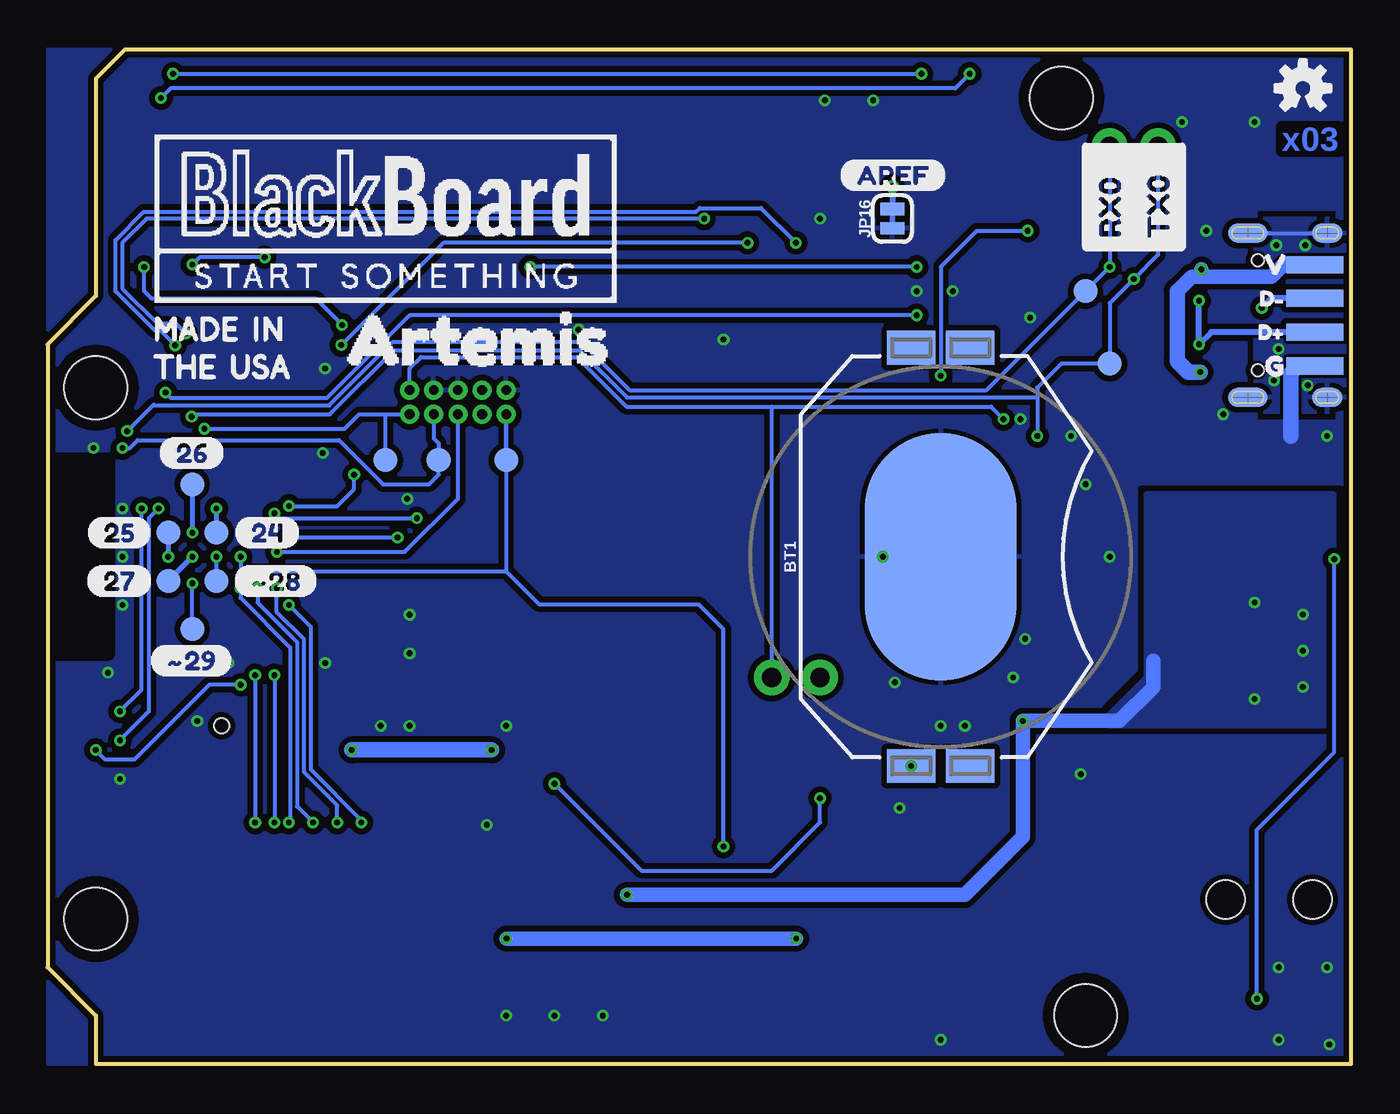
[diagram p3: board, bottom side, seen from below]

Size 68.58 x 53.34 mm. Coordinates in mm from the lower left corner, seen from the top.
Outline: 0,53.34 64.52,53.34 66.04,51.82 66.04,40.39 68.58,37.85 68.58,5.08 66.04,2.54 66.04,0 0,0 0,53.34
Copper layers (1*16): Top 0.035mm / dielectric 1.5mm / Bottom 0.035mm
Design rules "SparkFun-2-layer-PCBWay-LIMIT": minimum track width 6mil, minimum drill 0.3mm, track to track 6mil, track to pad 6mil, pad to pad 6mil, via to via 6mil, smd to smd 6mil, copper to edge 6mil, drill to drill 6mil, minimum pad ring 6mil, minimum via ring 6mil, stop-mask expansion 4mil, vias tented up to drill 25mil, thermal gap 10mil
tRestrict: area 65.4,21.6 to 68.6,31.8
bRestrict: area 65.4,21.6 to 68.6,31.8
vRestrict: area 0.6,22.4 to 2,30.6; area 5.7,23.1 to 7.4,30.6; area 47.9,10.8 to 48.5,11.3; area 50.4,10.7 to 50.9,11.6; area 11.3,29.3 to 12.7,31.6; area 0.3,13 to 9.4,25

### Footprints (pad centres in the part's own frame; a part is rotated, then mirrored left to right if it is on the bottom)
BATTCON_20MM_4LEGS_OVERPASTE = smd 1.778 x 2.54: 1 -11,1.55; 3 11,1.55; P$1 -11,-1.55; P$2 11,-1.55 | smd 13 x 8: 2 0,0
0603 = smd 1.1 x 1: 1 -0.85,0; 2 0.85,0
EIA3216 = smd 1.4 x 1.6: + 1.4,0; - -1.4,0
PANASONIC_D = smd 3 x 1.4: + 2.4,0; - -2.4,0
SMA-DIODE = smd 1.27 x 1.47: A -2.15,0; C 2.15,0
LED-1206 = smd 1.2 x 1.4: A -1.5,0; C 1.5,0
SOD-323 = smd 0.63 x 0.83: A 1.15,0; C -1.15,0
SPH0641LM4H-1_MICROPHONE = smd 0.725 x 0.522: 1 -0.9,1.3; 2 -0.9,0.3; 4 0.9,0.3; 5 0.9,1.3 | smd 0.5 x 0.2: 3 0,-1.65; 8 0,-0.35 | smd 0.2 x 0.5: 6 -0.65,-1; 7 0.65,-1 | hole 0.8: 0,-1
1210 = smd 1 x 2.8: 1 -1.5,0; 2 1.5,0
SOT223-ALT1 = smd 0.838 x 1.524: 1 -2.271,-3.02; 2 0,-3.02; 3 2.288,-3.02 | smd 3.124 x 1.778: 4 0,2.921
1X02_NO_SILK = drill 1.016 pad 1.88: 1 0,0; 2 2.54,0
2X5-PTH-1.27MM-NO_SILK = drill 0.508 pad 1: 1 -2.54,-0.635; 2 -2.54,0.635; 3 -1.27,-0.635; 4 -1.27,0.635; 5 0,-0.635; 6 0,0.635; 7 1.27,-0.635; 8 1.27,0.635; 9 2.54,-0.635; 10 2.54,0.635
POWER_JACK_SMD_OVERPASTE_TOE = smd 2.8 x 2.4: GND 0,-5.7; P$4 6.1,-5.7; VIN0 0,5.7; VIN1 6.1,5.7 | hole 2.032: 0,0; 4.572,0
JST04_1MM_RA = smd 0.6 x 1.35: 1 -1.5,0; 2 -0.5,0; 3 0.5,0; 4 1.5,0 | smd 1.2 x 2: NC1 2.8,-3.675; NC2 -2.8,-3.675
USB-C-16P = smd 0.3 x 1.016: A5 -1.25,0.154; A6 -0.25,0.154; A7 0.25,0.154; A8 1.25,0.154; B5 1.75,0.154; B6 0.75,0.154; B7 -0.75,0.154; B8 -1.75,0.154 | smd 0.6 x 1.016: GND -3.225,0.154; GND2 3.225,0.154 | smd 1 x 2.1: SHLD1 -4.32,-0.915; SHLD2 4.32,-0.915 | smd 1 x 2.1 bottom: SHLD3 -4.32,-0.915; SHLD4 4.32,-0.915 | smd 1 x 1.6: SHLD5 -4.32,-5.095; SHLD8 4.32,-5.095 | smd 1 x 1.6 bottom: SHLD6 -4.32,-5.095; SHLD7 4.32,-5.095 | smd 0.55 x 1.016: VBUS1 -2.45,0.154; VBUS2 2.45,0.154 | hole 0.65: -2.89,-1.445; 2.89,-1.445
1X10_SMD_COMBINED = smd 1 x 2: 1A 0,1.65; 1B 0,-1.65; 2A 2.54,1.65; 2B 2.54,-1.65; 3A 5.08,1.65; 3B 5.08,-1.65; 4A 7.62,1.65; 4B 7.62,-1.65; 5A 10.16,1.65; 5B 10.16,-1.65; 6A 12.7,1.65; 6B 12.7,-1.65; 7A 15.24,1.65; 7B 15.24,-1.65; 8A 17.78,1.65; 8B 17.78,-1.65; 9A 20.32,1.65; 9B 20.32,-1.65; 10A 22.86,1.65; 10B 22.86,-1.65
STAND-OFF = hole 3.302: 0,0
FIDUCIAL-1X2 = smd 1 x 1: 1 0,0
1X08_SMD_COMBINED = smd 1 x 2: 1A 0,1.65; 1B 0,-1.65; 2A 2.54,-1.65; 2B 2.54,1.65; 3A 5.08,1.65; 3B 5.08,-1.65; 4A 7.62,-1.65; 4B 7.62,1.65; 5A 10.16,1.65; 5B 10.16,-1.65; 6A 12.7,-1.65; 6B 12.7,1.65; 7A 15.24,1.65; 7B 15.24,-1.65; 8A 17.78,-1.65; 8B 17.78,1.65
SMT-JUMPER_2_NO_SILK = smd 0.635 x 1.27: 1 -0.406,0; 2 0.406,0
1X06_SMD_STRAIGHT_COMBO = smd 1 x 2: 1A 0,-1.65; 1B 0,1.65; 2A 2.54,1.65; 2B 2.54,-1.65; 3A 5.08,-1.65; 3B 5.08,1.65; 4A 7.62,1.65; 4B 7.62,-1.65; 5A 10.16,-1.65; 5B 10.16,1.65; 6A 12.7,1.65; 6B 12.7,-1.65
USB-SOLDER-PADS = smd 3 x 0.9: D+ 0,-0.889; D- 0,0.889; GND 0,-2.667; VBUS 0,2.667
SMT-JUMPER_2_NC_TRACE_SILK = smd 0.635 x 1.27: 1 -0.508,0; 2 0.508,0
SOT23-3 = smd 0.8 x 0.9: 1 -0.95,-1; 2 0.95,-1; 3 0,1.1
TACTILE_SWITCH_SMD_5.2MM = smd 1.524 x 0.762: 1 -2.794,1.905; 2 2.794,1.905; 3 -2.794,-1.905; 4 2.794,-1.905
PAD.03X.05 = smd 1.27 x 1.27: P$1 0,0
ARTEMIS_FP = smd 0.4 x 0.6: AD16 -4,-3.7; BOOT 1.5,4.5; D0 0.5,-4.5; D1 -0.5,-4.5; D2 -1,-3.7; D3 2,-3.7; D7 -1.5,4.5; D8 -0.5,4.5; D9 2,3.7; D10 1,3.7; D14 -5,3.7; D17 -3.5,-4.5; D36 2.5,-4.5; D38 3,-3.7; D40 2.5,4.5; D41 -2.5,-4.5; GND@1 4.5,4.5; GND@39 -5.5,-4.5; GND@47 -1.5,-4.5; GND@59 4.5,-4.5; RXI-0 3.5,4.5; SWDCK 4,3.7; SWDIO 0,3.7; TXO-0 0.5,4.5; ~AD31 -3,-3.7; ~AD35 -2,3.7; ~D4 -2.5,4.5; ~D5 -1,3.7; ~D18 -4.5,-4.5; ~D19 -5,-3.7; ~D22 -3.5,4.5; ~D23 -4,3.7; ~D24 -3,3.7; ~D27 -4.5,4.5; ~D28 -5.5,4.5; ~D37 3.5,-4.5; ~D39 3,3.7; ~D42 1.5,-4.5; ~D43 1,-3.7; ~D44 4,-3.7; ~D45 -2,-3.7; ~RST 0,-3.7 | smd 0.6 x 0.4: AD34 -6.5,-0.5; D15 -6.5,0.5; VDD@36 -5.7,-3; VDD@37 -6.5,-3.5; XI -6.5,-2.5; XO -5.7,-2; ~AD11 -5.7,-1; ~AD12 -5.7,2; ~AD13 -5.7,1; ~AD29 -6.5,-1.5; ~AD32 -5.7,3; ~AD33/SWO -5.7,0; ~D6 -6.5,3.5; ~D25 -6.5,2.5; ~D26 -6.5,1.5 | smd 0.6 x 0.6: GND@22 -6.5,4.5; GND@38 -6.5,-4.5
SOT23-5 = smd 0.55 x 1.2: 1 -0.95,-1.3; 2 0,-1.3; 3 0.95,-1.3; 4 0.95,1.3; 5 -0.95,1.3
SO016 = smd 0.6 x 1.2: 1 -4.445,-2.8; 2 -3.175,-2.8; 3 -1.905,-2.8; 4 -0.635,-2.8; 5 0.635,-2.8; 6 1.905,-2.8; 7 3.175,-2.8; 8 4.445,-2.8; 9 4.445,2.8; 10 3.175,2.8; 11 1.905,2.8; 12 0.635,2.8; 13 -0.635,2.8; 14 -1.905,2.8; 15 -3.175,2.8; 16 -4.445,2.8
CRYSTAL-SMD-3.2X1.5MM = smd 1 x 1.8: P$1 -1.25,0; P$2 1.25,0

### Placement (x,y rotation side)
BT1  21.59,26.67 90 bottom
C1  19.05,39.12 0 top
C2  51.82,22.23 0 top
C3  20.32,13.46 180 top
C4  10.16,26.16 0 top
C5  21.59,5.84 90 top
C6  20.32,22.35 0 top
C7  51.82,20.7 180 top
C8  19.05,42.16 0 top
C9  51.82,19.05 180 top
C10  1.78,29.59 180 top
C11  51.82,28.83 0 top
C12  10.16,27.69 0 top
C13  51.82,23.75 0 top
C15  10.67,30.48 180 top
C16  20.32,20.32 180 top
C17  12.7,33.02 0 top
C18  12.7,45.72 180 top
C19  55.5,17.78 90 top
C28  16,47.24 0 top
D1  16,8.38 90 top
D2  21.59,31.75 180 top
D3  21.59,27.94 180 top
D4  25.4,16.51 270 top
D5  27.94,16.51 270 top
E1  58.42,17.78 90 top
F2  5.71,30.48 0 top
FRAME1  -5.08,-38.1 0 top  (outside the outline)
FRAME2  36.83,21.59 270 bottom
IC3  7.62,21.59 90 top
J1  30.48,20.32 180 top
J2  46.99,34.8 180 top
J3  2.03,8.64 0 top
J4  63.5,16.51 90 top
J5  6.35,39.37 270 top
J7  12.7,48.26 180 top
JP1  33.66,33.4 0 top
JP2  18.8,50.8 0 top
JP3  13.97,2.54 0 top
JP4  66.04,7.62 0 top
JP5  66.04,35.56 0 top
JP6  15.24,50.8 0 top
JP7  35.31,35.94 0 top
JP8  65.91,4.32 0 top
JP9  11.43,52.07 0 top
JP10  45.72,2.54 180 top
JP11  63.5,50.8 180 top
JP12  8.76,32.89 270 top
JP13  50.8,2.54 0 top
JP14  1.91,39.37 0 bottom
JP15  30.48,17.78 0 top
JP16  24.13,44.45 90 bottom
LED1  21.59,35.56 180 top
LED2  39.37,12.7 0 top
Q1  6.35,26.92 270 top
R1  21.59,33.66 0 top
R2  39.37,14.73 0 top
R3  16,45.72 180 top
R4  3.81,26.8 270 top
R5  19.05,40.64 180 top
R7  1.78,31.37 0 top
R8  9.4,45.72 180 top
R9  19.05,37.59 0 top
R12  21.59,26.04 180 top
R14  13.34,17.27 180 top
R15  13.34,19.81 0 top
R16  21.59,29.84 180 top
S1  5.08,49.53 180 top
TP1  48.01,31.75 90 bottom
TP2  50.8,31.75 90 bottom
TP3  44.45,31.75 0 bottom
TP5  13.97,40.64 90 bottom
TP6  12.7,36.83 90 bottom
TP8  60.96,22.86 270 bottom
TP9  59.69,25.4 270 bottom
TP11  62.23,25.4 0 bottom
TP12  59.69,27.94 0 bottom
TP13  62.23,27.94 0 bottom
TP14  60.96,30.48 0 bottom
U1  60.58,26.67 0 top
U3  20.32,17.78 270 top
U5  12.7,39.37 270 top
U$1  [BLACKBOARDLOGO#PNG]  38.1,26.67 0 top
U$2  [D#3]  5.59,38.48 0 bottom
U$3  [BLACKBOARDLOGO#PNG]  50.8,44.45 0 bottom
U$4  [MADEINUSA#PNG]  59.44,37.59 0 bottom
U$9  [QWIIC_COPYRIGHT_SMALL]  61.72,16.51 90 top
U$10  [D#4]  5.46,40.26 0 bottom
U$11  [G1]  5.46,36.7 0 bottom
U$12  [V0]  5.46,42.04 0 bottom
U$13  [3#3V_MAX2]  52.32,12.19 0 top
U$14  [ARTEMIS0]  34.04,20.32 0 top
U$15  [ARTEMIS0]  55.12,38.1 0 bottom
U$16  2.54,51.31 0 bottom
U$17  [#284]  58.8,25.4 0 bottom
U$18  [SCL1]  18.8,43.43 90 top
U$19  [#295]  63.25,21.21 0 bottom
U$20  [AREF2]  26.92,46.74 0 bottom
U$21  [240]  58.8,27.94 0 bottom
U$22  [SDA0]  21.34,43.43 90 top
U$23  [251]  66.55,27.94 0 bottom
U$24  [262]  62.74,32.13 0 bottom
U$25  [273]  66.55,25.4 0 bottom
U$47  [MISO8]  31.5,42.55 90 top
U$48  [MOSI7]  34.04,42.55 90 top
U$49  [RX01]  12.7,42.42 90 bottom
U$50  [SCK9]  28.96,43.43 90 top
U$53  [TX00]  10.16,42.42 90 bottom
U$67  [3#3V_MAX2]  39.37,41.91 0 top
U$68  [BYP0]  3.05,32.89 0 top
U$70  [MEAS3]  28.96,15.75 0 top
U$71  [RX11]  63.37,43.43 90 top
U$72  [TX10]  60.96,43.31 90 top
Y1  51.82,26.29 90 top

### Tracks (layer width: path | path; a pad name or v marks a point on that pad's centre or on a via)
3.3V  (via drill 0.3)
  Top 0.203: v17.02,43.81 U5.16 14.35,43.81 13.55,44.62 C18.1 | C6.+ 21.72,24.25 20.74,25.23 R12.2 20.74,26.71 21.08,27.05 21.08,28.96 20.74,29.3 R16.2 20.74,30.52 21.59,31.37 v21.59,36.2 | R2.2 v41.91,14.73 | v27.94,13.97 D5.A
  Top 0.508: 21.59,18.76 U3.5
  Top 0.813: C6.+ 21.72,21.21 21.17,20.66 C16.1 21.17,19.47 21.59,19.05 21.59,18.76 | U3.5 22.55,18.73 24.77,16.51 26.79,16.51 D5.A
  Bottom 0.203: v17.02,43.81 19.68,43.81 21.59,41.91 v21.59,36.2 | v41.91,14.73 37.34,10.16 30.48,10.16 27.94,12.7 v27.94,13.97
5V  (via drill 0.3)
  Top 0.406: IC3.2 12.95,21.59 14.19,20.36 R15.2
  Top 0.508: 18.92,16.73 U3.3
  Top 0.762: JP10.4B JP10.4A v38.1,8.89
  Top 0.813: C3.+ 18.92,16.73 | v5.08,24.27 5.35,24.54 Q1.2 3.84,25.97 R4.2 | U3.3 17.59,16.83 17.27,17.14 v17.27,18.03 17.27,18.54 17.46,18.73 U3.1 | C4.1 9.31,24.68 9.02,24.38
  Bottom 0.762: v38.1,8.89 20.32,8.89 17.27,11.94 v17.27,18.03 12.19,18.03 10.41,19.81 10.41,21.21
  other vias: 2.54,21.73 5.08,19.19 2.54,19.82 2.54,23.63
  pour Bottom (isolate 0.305, no thermals): 0.89,29.97 10.79,29.97 10.79,20.32 12.7,18.41 12.7,17.78 0.89,17.78
  pour Top (isolate 0.305, no thermals): 0.89,17.78 0.89,24.77 11.43,24.77 11.43,17.78
!DTR
  Top 0.203: R5.2 C1.1 | U5.13 16.51,40.01 17.14,40.64 R5.2 | C8.1 R5.2
!RESET  (via drill 0.3)
  Top 0.203: JP10.6B JP10.6A v33.02,11.43 | S1.4 S1.3 10.79,51.44 11.43,50.8 11.43,47.5 11.94,46.99 14.22,46.99 14.48,47.24 C28.1 16.68,45.72 R3.1 18.8,45.72 19.9,44.62 C8.2 22.61,42.16 v22.86,41.91 | v43.18,41.91 43.18,35.43 J2.10 | U1.~RST 60.58,23.5 59.31,24.77 59.31,25.78 v58.42,26.67
  Bottom 0.203: v22.86,41.91 v43.18,41.91 | v33.02,11.43 33.02,22.86 34.33,24.17 42.71,24.17 44.45,25.91 | 44.45,25.91 J2.10 TP3.P$1 | 44.45,25.91 58.42,25.91 v58.42,26.67
BOOT  (via drill 0.3)
  Top 0.203: R9.2 C1.2 22.61,39.12 v22.86,39.37 | v62.37,35.31 62.08,35.01 U1.BOOT
  Bottom 0.203: v62.37,35.31 62.09,35.03 53.87,35.03 49.53,39.37 v22.86,39.37
CC1
  Top 0.203: J5.A5 3.96,40.62 3.17,41.4 3.17,45.09 3.81,45.72 R8.2
CC2
  Top 0.203: J5.B5 4.73,37.62 3.43,36.32 3.43,33.69 2.63,32.89 R7.2
D14/SDA  (via drill 0.3)
  Top 0.203: v61.98,52.07 61.98,39.09 63.08,37.99 U1.D40 63.03,31.12 63.03,29.96 62.74,29.67 v62.74,29.21 | J4.3 v64.77,17.02 | JP2.2A 21.34,51.94 | 21.34,51.94 JP2.2B | v22.61,52.07 21.46,52.07 21.34,51.94
  Bottom 0.203: v61.98,52.07 v22.61,52.07 | v62.74,29.21 63.25,28.7 63.25,18.54 v64.77,17.02
D18/A2  (via drill 0.3)
  Top 0.203: U1.AD34 56.51,26.17 57.53,25.15 v57.53,25.02 | JP13.3A JP13.3B 55.88,11.43 v54.61,12.7
  Bottom 0.203: v57.53,25.02 57.53,24.26 55.45,22.18 55.45,13.54 v54.61,12.7
D20/A4  (via drill 0.3)
  Top 0.203: JP13.5A JP13.5B 60.96,8.38 v56.64,12.7 | U1.AD16 56.58,20.51 v56.64,20.45
  Bottom 0.203: v56.64,20.45 v56.64,12.7
D24  (via drill 0.3)
  Top 0.203: U1.D8 60.08,29.6 v59.69,29.21
  Bottom 0.254: TP12.P$1 v59.69,29.21
D25  (via drill 0.3)
  Top 0.203: v62.23,26.67 62.23,28.93 62.18,28.98 62.18,29.97 U1.D9
  Bottom 0.254: TP13.P$1 v62.23,26.67
D26  (via drill 0.3)
  Top 0.203: U1.D10 61.58,28.56 v60.96,27.94
  Bottom 0.254: TP14.P$1 v60.96,27.94
D27  (via drill 0.3)
  Top 0.203: U1.D38 63.58,24.3 61.21,26.67 v60.96,26.67
  Bottom 0.254: TP11.P$1 v60.96,26.67
D+  (via drill 0.3)
  Top 0.305: J5.A6 8.01,39.62 8.01,39.75 | 8.01,39.75 9.02,38.73 U5.5 | J5.B6 7.48,38.62 8,38.1 v8,37.85 | v8,40.13 v8.01,40.13 8.01,39.75
  Bottom 0.305: v8,40.13 v8,37.85 7.37,38.48 JP14.D+
D-  (via drill 0.3)
  Top 0.305: J5.B7 5.07,40.12 v4.7,39.75 v4.71,39.74 4.71,39.5 5.08,39.12 J5.A7 7.87,39.12 9.53,37.47 U5.6
  Bottom 0.305: JP14.D- 4.19,40.26 v4.7,39.75
GND  (via drill 0.3)
  Top 0.203: JP10.2B 42.42,0.89 42.23,1.08 | 42.23,1.08 41.91,1.4 v41.91,2.54 | JP10.3A 42.04,0.89 42.23,1.08 | E1.7 58.94,18.43 58.77,18.25 E1.8 | E1.7 59.42,20.72 v59.05,21.08 | E1.3 60.07,18.16 59.8,18.43 E1.7 | E1.6 59.07,17.13 58.77,17.43 E1.8 | U1.GND@1 65.08,29.65 v64.64,29.21 | v64.64,24.13 65.08,23.69 U1.GND@59 | E1.8 | LED1.C 20.09,34.41 19.94,34.26 19.94,33.78 19.3,33.15 17.78,33.15 17.4,33.53 v17.4,33.91
  Top 0.305: U1.GND@1 65.08,31.8 65.53,32.26 66.04,32.26 v66.17,32.38 | U1.GND@59 65.08,20.9 v65.41,20.57
  Top 0.508: 6.94,34.65 6.35,34.06 | 6.65,36.15 7.37,35.43
  Bottom 0.813: JP14.GND 2.79,36.7 3.17,36.32 3.17,33.02
  other vias: 5.08,49.53 27.69,50.67 1.27,5.08 27.94,44.45 17.78,20.32 14.22,15.24 6.73,34.16 13.97,30.48 14.73,33.02 12.7,26.67 11.43,43.69 8.89,49.53 23.75,13.46 7.62,43.81 1.27,33.02 20.32,17.78 21.59,17.78 24,20.07 17.14,22.35 3.81,1.27 3.81,5.08 1.14,1.02 21.59,1.27 44.45,2.54 39.37,2.54 16.89,39.24 22.86,40.64 20.95,40.64 64.77,14.99 45.47,12.57 25.15,50.67 24.64,26.67 33.02,38.1 40.64,38.61 44.45,17.78 49.53,23.62 53.98,21.08 64.64,26.67 53.98,36.58 54.1,32.13 51.05,17.78 49.53,21.59 49.53,17.78 49.66,29.72 60.71,18.03
  pour Top (isolate 0.305, rank 2): 0,53.34 68.58,53.34 68.58,0 0,0
  pour Bottom (isolate 0.305, rank 2): 0,53.34 68.58,53.34 68.58,0 0,0
INSERT  (via drill 0.3)
  Top 0.203: J3.P$4 5.45,2.94 v4.95,3.43 | R4.1 1.99,27.65 v0.89,26.54 | Q1.1 4.04,27.87
  Top 0.305: 4.04,27.87 R4.1
  Bottom 0.203: v4.95,3.43 4.95,12.32 0.89,16.38 v0.89,26.54
N$1
  Top 0.203: R1.2 23.09,34.3 LED1.A
N$2
  Top 0.203: R2.1 38.52,14.14 37.87,13.49 LED2.A
N$3
  Top 0.203: JP15.1 29.72,17.78
  Top 0.813: D4.C D5.C | D5.C 28.06,17.78 29.72,17.78 | J1.2 D5.C
N$4
  Top 0.813: 30.1,17.78 30.86,17.78
N$5
  Top 0.203: R16.1 22.44,30.44 23.09,31.09 D2.A
N$6
  Top 0.203: U5.4 11.05,40.01 11.85,39.2 C17.1
N$7
  Top 0.203: U1.XO 53.56,24.67 53.21,25.02 53.21,26.92 52.58,27.56 52.07,27.56 | 52.07,27.56 51.84,27.56 Y1.P$2 | C11.2 52.07,28.23 52.07,27.56
N$8
  Top 0.203: U1.XI 53.09,24.17 C13.2 52.67,24.19 Y1.P$1
N$9
  Top 0.203: R12.1 22.44,26.63 23.09,27.28 D3.A
N$10  (via drill 0.38)
  Top 0.381: JP2.3A JP2.3B 23.88,46.38 v24.13,46.13
  Bottom 0.305: v24.13,46.13 JP16.2
N$15
  Top 0.406: IC3.1 11.32,19.32 11.81,19.81 R15.1 R14.2
PDMCLK  (via drill 0.3)
  Top 0.203: E1.4 58.12,19.64 v58.42,19.94 | v66.04,16.51 66.04,18.41 64.08,20.38 U1.~D37
  Bottom 0.203: v58.42,19.94 60.07,19.94 64.01,16 65.53,16 v66.04,16.51
PDMDATA
  Top 0.203: U1.D36 63.08,19.39 59.69,16 57.28,16 57.12,16.16 E1.1
PWRIN
  Top 0.813: J3.VIN0 2.03,13.21 4.32,10.92 8.51,10.92 13.2,6.23 D1.A
RXI-0  (via drill 0.3)
  Top 0.178: U5.2 12.06,42.55 v12.7,41.91
  Top 0.203: v12.7,41.91 TP5.P$1 13.97,34.9 15.62,33.24 15.62,31.37 19.05,27.94 D3.C | U1.RXI-0 64.08,32.96 v64.39,33.27
  Bottom 0.203: v64.39,33.27 62.99,34.67 62.99,34.63 53.76,34.63 50.42,37.97 40.51,37.97 37.97,35.43 19.18,35.43 TP5.P$1 v12.7,41.91 J7.1
SHLD  (via drill 0.3)
  Bottom 0.203: J5.SHLD1 J5.SHLD5
  other vias: 2.41,43.05 3.94,43.05 3.81,37.59 4.06,35.94 2.29,35.69
  pour Bottom: 0,44.45 5.08,44.45 5.08,34.29 0,34.29
  pour Top: 0,44.45 5.08,44.45 5.08,34.29 0,34.29
SWDCK  (via drill 0.3)
  Top 0.203: U1.SWDCK 64.58,32.32 v64.64,32.38
  Bottom 0.203: J2.4 48.26,32.89 48.01,32.64 TP1.P$1 48.01,30.99 48.51,30.48 50.93,30.48 53.25,32.8 63.84,32.8 64.26,32.38 v64.64,32.38
SWDIO  (via drill 0.3)
  Top 0.203: v60.33,33.4 60.58,33.15 U1.SWDIO
  Bottom 0.203: v60.33,33.4 52.96,33.4 52.2,34.16 50.8,34.16 | 50.8,34.16 J2.2 | TP2.P$1 50.8,34.16
TXO-0  (via drill 0.3)
  Top 0.178: U5.3 v11.43,41.27
  Top 0.203: D2.C 17.78,31.75 v16.51,33.02 | v61,34.04 61.08,33.95 U1.TXO-0
  Bottom 0.203: 16.51,35.05 v16.51,33.02 | v61,34.04 60.87,34.16 53.73,34.16 50.36,37.53 40.58,37.53 38.1,35.05 16.51,35.05 | 16.51,35.05 16.51,35.56 15.24,36.83 TP6.P$1 12.7,40.01 v11.43,41.27 10.16,42.55 J7.2
USBVCC
  Top 0.254: JP12.2 8.76,32.28
  Top 0.813: F2.2 C15.+ | C15.+ 8.76,30.98 8.76,32.28 | Q1.3 7.87,26.92 8.64,27.69 | 8.64,27.69 C12.1 | C15.+ 9.27,28.32 8.64,27.69
V_BATT  (via drill 0.3)
  Top 0.203: BT1.1 23.45,15.36 D4.A
  other vias: 23.14,15.67
VDD  (via drill 0.3)
  Top 0.203: 33.02,16.51 33.02,13.97 30.48,11.43 JP10.7B JP10.7A | v18.29,33.91 19.1,34.72 19.1,42.88 17.4,44.58 15.62,44.58 15.15,45.05 R3.2 | E1.2 58.12,17.3 57.64,17.78 57.15,17.78 | v52.58,16.51 53,16.93 C19.1 55.79,16.93 56.64,17.78 57.15,17.78 | 57.15,17.78 57.12,17.81 E1.5
  Top 0.508: v52.58,16.51 52.67,16.6 C9.1 C7.1 C2.2 52.88,22.23 53.82,23.17 U1.VDD@37 54.38,23.17 U1.VDD@36
  Top 0.762: JP10.5B JP10.5A
  Top 0.813: 35.56,16.51 33.02,16.51 31.75,17.78 JP15.2 30.99,19.81 J1.1 | 35.56,16.51 v45.21,16.51 | JP10.5A 35.56,16.51 | v52.58,16.51 53.89,15.2 61.3,15.2 62.11,16.01 J4.2
  Bottom 0.203: J2.1 49.53,36.58 48.93,37.17 40.73,37.17 38.12,34.57 30.48,34.57 | J1.1 30.48,34.57 | 30.48,34.57 18.95,34.57 v18.29,33.91
  Bottom 0.813: v45.21,16.51 v52.58,16.51
VIN  (via drill 0.3)
  Top 0.762: IC3.3 13.72,23.88 16,21.59 D1.C 16,9.4 17.16,8.24 C5.+ 25.14,8.24 26.79,6.59 v29.2,6.59 | JP10.1A JP10.1B 45.72,6.1 45.21,6.6 45.2,6.59 v44.44,6.59
  Bottom 0.762: v29.2,6.59 v44.44,6.59
VUSB  (via drill 0.3)
  Top 0.254: 8.76,33.4 JP12.1 8.64,33.43
  Top 0.305: C10.1 3.94,29.59 3.94,30.2 F2.1
  Top 0.635: J5.VBUS2 7.4,36.92 v7.94,36.39 | J5.VBUS1 7.84,41.82
  Top 0.762: 7.84,41.82 v7.87,41.78
  Top 0.813: F2.1 4.21,32.16 4.61,32.55 6.6,32.55 7.46,33.4 8.76,33.4 | v7.94,36.39 8.64,35.69 8.64,33.43
  Bottom 0.762: JP14.VBUS 3.56,42.04 4.19,41.4 7.87,41.4 | 9.14,40.64 8.38,41.4 7.87,41.4 | v7.87,41.78 7.87,41.4
  Bottom 0.813: 9.14,40.64 9.14,36.96 8.57,36.39 v7.94,36.39
~D0/RXI-1  (via drill 0.3)
  Top 0.203: v63.5,41.91 JP11.1A JP11.1B | v53.09,38.86 52.45,38.23 v52.45,30.99 | U1.~D25 55.71,29.17 v55.88,29.34
  Bottom 0.203: v53.09,38.86 54.48,40.26 63.12,40.26 63.5,40.64 v63.5,41.91 | v55.88,29.34 53.34,29.34 52.45,30.23 v52.45,30.99
~D1/TXO-1  (via drill 0.3)
  Top 0.203: v60.96,42.04 JP11.2B JP11.2A | U1.~D24 57.58,41.99 v57.15,42.42
  Bottom 0.203: v57.15,42.42 60.58,42.42 v60.96,42.04
~D2/A6
  Top 0.203: JP11.3B JP11.3A 58.42,43.69 58.58,43.53 U1.~AD35
~D3
  Top 0.203: JP11.4A JP11.4B 55.88,45.59 58.08,43.39 U1.~D4
~D4
  Top 0.203: JP11.5B JP11.5A 53.34,44.98 57.08,41.24 U1.~D22
~D5
  Top 0.203: JP11.6A JP11.6B 50.8,46.14 56.58,40.36 U1.~D23
~D6
  Top 0.203: JP11.7B JP11.7A 48.26,48.14 56.08,40.32 U1.~D27
~D7
  Top 0.203: JP11.8A JP11.8B 45.72,46.99 46.99,45.72 50.14,45.72 55.08,40.78 U1.~D28
~D8/A8
  Top 0.203: JP2.10A JP2.10B 41.66,31.62 42.93,30.35 52.32,30.35 53.01,29.67 U1.~AD32
~D9/A9  (via drill 0.3)
  Top 0.203: JP2.9A JP2.9B 39.12,30.73 41.15,28.7 v49.15,28.7 | U1.~AD12 56.36,28.67 v56.64,28.96
  Bottom 0.203: v56.64,28.96 56.39,28.7 v49.15,28.7
~D10/A10  (via drill 0.3)
  Top 0.203: JP2.8A JP2.8B 36.58,30.73 39.64,27.67 39.66,27.69 v50.16,27.69 | U1.~AD13 55.86,27.67 v55.88,27.69
  Bottom 0.203: v55.88,27.69 v50.16,27.69
~D11/MOSI  (via drill 0.3)
  Top 0.203: JP2.7A JP2.7B v34.04,44.45 | v61.3,38.41 59.08,36.19 U1.D7
  Bottom 0.203: v61.3,38.41 61.8,38.91 62.78,38.91 64.64,40.78 64.64,43.18 63.37,44.45 v34.04,44.45
~D12/MISO  (via drill 0.3)
  Top 0.203: JP2.6A JP2.6B 31.5,43.43 v31.75,43.18 | U1.~D6 53.4,30.17 53.09,30.48 53.09,37.59 53.13,37.63 v53.13,37.8
  Bottom 0.203: v53.13,37.8 47.75,43.18 v31.75,43.18
~D13/SCK  (via drill 0.3)
  Top 0.203: JP2.5B 28.96,43.43 v29.21,43.18 29.21,39.5 27.43,37.72 22.1,37.72 20.94,36.56 20.94,34.76 20.74,34.55 R1.1 | v61.86,37.79 61.73,37.79 59.58,35.64 U1.~D5
  Top 0.254: JP2.5B JP2.5A
  Bottom 0.203: v61.86,37.79 62.63,38.56 62.93,38.56 65,40.63 65,43.33 63.52,44.81 34.47,44.81 34.27,45.01 31.04,45.01 v29.21,43.18
~D15/SCL  (via drill 0.3)
  Top 0.203: v62.61,50.8 62.61,38.96 63.58,37.99 U1.~D39 63.58,29.26 v63.63,29.21 | J4.4 64.24,18.01 v64.77,18.54 | v20.07,52.07 19.18,52.07 JP2.1A JP2.1B
  Bottom 0.203: v20.07,52.07 20.83,51.31 62.1,51.31 v62.61,50.8 | v64.77,18.54 63.63,19.68 v63.63,29.21
~D16/A0  (via drill 0.3)
  Top 0.203: U1.~AD29 55.6,25.17 55.88,24.89 v55.88,24.13 | JP13.1A JP13.1B 50.8,11.43 v52.07,12.7
  Bottom 0.203: v55.88,24.13 54.74,22.99 54.74,15.49 52.07,12.83 v52.07,12.7
~D17/A1  (via drill 0.3)
  Top 0.203: U1.~AD11 55.86,25.67 v56.52,25.02 | JP13.2B JP13.2A v53.34,12.7
  Bottom 0.203: v53.34,12.7 53.34,13.59 55.09,15.35 55.09,22.33 56.52,23.75 v56.52,25.02
~D19/A3  (via drill 0.3)
  Top 0.203: U1.~AD33/SWO 56.28,26.67 56.52,26.91 v56.52,26.92 56.77,26.67 57.15,26.67 58.42,25.4 v58.42,25.02 | JP13.4B JP13.4A 58.42,10.16 56.44,12.14 56.41,12.14 56.08,12.47 56.08,12.5 v55.88,12.7
  Bottom 0.203: J2.6 46.99,29.72 49.78,26.92 v56.52,26.92 | v58.42,25.02 58.42,24.51 55.8,21.89 55.8,12.78 v55.88,12.7
~D21/A5  (via drill 0.3)
  Top 0.203: JP13.6B JP13.6A 63.5,6.86 v57.66,12.7 | U1.~AD31 57.58,20.53 v57.66,20.45
  Bottom 0.203: v57.66,20.45 v57.66,12.7
~D28  (via drill 0.3)
  Top 0.203: v59.69,26.67 60.53,25.83 61.19,25.83 62.08,24.94 U1.~D42
  Bottom 0.203: TP9.P$1 v59.69,26.67
~D29  (via drill 0.3)
  Top 0.203: U1.~D43 61.58,24.65 v60.96,25.27
  Bottom 0.203: TP8.P$1 v60.96,25.27

### Text on the board
Bottom: x03
Measures: Units in inches
214bmp: D:/SmartProjects/Snc/a4_bn_logo2.bmp